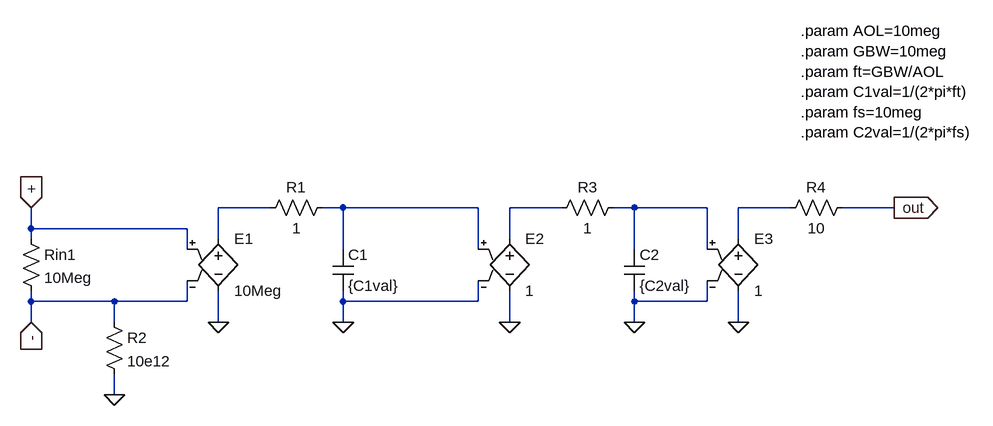
[diagram p0: schematic behavioral_opamp_subcircuit.asc]
behavioral_opamp_subcircuit.asc, the LTspice schematic file:
Version 4
SHEET 1 1140 680
WIRE -144 0 -224 0
WIRE -32 0 -64 0
WIRE 176 0 -32 0
WIRE 304 0 224 0
WIRE 416 0 384 0
WIRE 528 0 416 0
WIRE 656 0 576 0
WIRE 816 0 736 0
WIRE -512 32 -512 0
WIRE -272 32 -512 32
WIRE -512 48 -512 32
WIRE -224 48 -224 0
WIRE 224 48 224 0
WIRE 576 48 576 0
WIRE -272 64 -272 32
WIRE -32 64 -32 0
WIRE 176 64 176 0
WIRE 416 64 416 0
WIRE 528 64 528 0
WIRE -512 144 -512 128
WIRE -384 144 -512 144
WIRE -272 144 -272 112
WIRE -272 144 -384 144
WIRE -32 144 -32 128
WIRE 176 144 176 112
WIRE 176 144 -32 144
WIRE 416 144 416 128
WIRE 528 144 528 112
WIRE 528 144 416 144
WIRE -512 176 -512 144
WIRE -384 176 -384 144
WIRE -224 176 -224 128
WIRE -32 176 -32 144
WIRE 224 176 224 128
WIRE 416 176 416 144
WIRE 576 176 576 128
WIRE -384 288 -384 256
FLAG -512 0 +
IOPIN -512 0 In
FLAG -512 176 -
IOPIN -512 176 In
FLAG -224 176 0
FLAG -32 176 0
FLAG -384 288 0
FLAG 224 176 0
FLAG 416 176 0
FLAG 576 176 0
FLAG 816 0 out
IOPIN 816 0 Out
SYMBOL res -528 32 R0
SYMATTR InstName Rin1
SYMATTR Value 10Meg
SYMBOL e -224 32 R0
SYMATTR InstName E1
SYMATTR Value 10Meg
SYMBOL res -48 -16 R90
WINDOW 0 0 56 VBottom 2
WINDOW 3 32 56 VTop 2
SYMATTR InstName R1
SYMATTR Value 1
SYMBOL cap -48 64 R0
SYMATTR InstName C1
SYMATTR Value {C1val}
SYMBOL res -400 160 R0
SYMATTR InstName R2
SYMATTR Value 10e12
SYMBOL e 224 32 R0
SYMATTR InstName E2
SYMATTR Value 1
SYMBOL res 400 -16 R90
WINDOW 0 0 56 VBottom 2
WINDOW 3 32 56 VTop 2
SYMATTR InstName R3
SYMATTR Value 1
SYMBOL cap 400 64 R0
SYMATTR InstName C2
SYMATTR Value {C2val}
SYMBOL e 576 32 R0
SYMATTR InstName E3
SYMATTR Value 1
SYMBOL res 752 -16 R90
WINDOW 0 0 56 VBottom 2
WINDOW 3 32 56 VTop 2
SYMATTR InstName R4
SYMATTR Value 10
TEXT 672 -272 Left 2 !.param AOL=10meg\n.param GBW=10meg\n.param ft=GBW/AOL\n.param C1val=1/(2*pi*ft)\n.param fs=10meg\n.param C2val=1/(2*pi*fs)

The netlist it stands for:
* behavioral_opamp_subcircuit.asc
Rin1 + - 10Meg
E1 N001 0 + - 10Meg
R1 N002 N001 1
C1 N002 0 {C1val}
R2 - 0 10e12
E2 N003 0 N002 0 1
R3 N004 N003 1
C2 N004 0 {C2val}
E3 N005 0 N004 0 1
R4 out N005 10
.param AOL=10meg
.param GBW=10meg
.param ft=GBW/AOL
.param C1val=1/(2*pi*ft)
.param fs=10meg
.param C2val=1/(2*pi*fs)
.backanno
.end